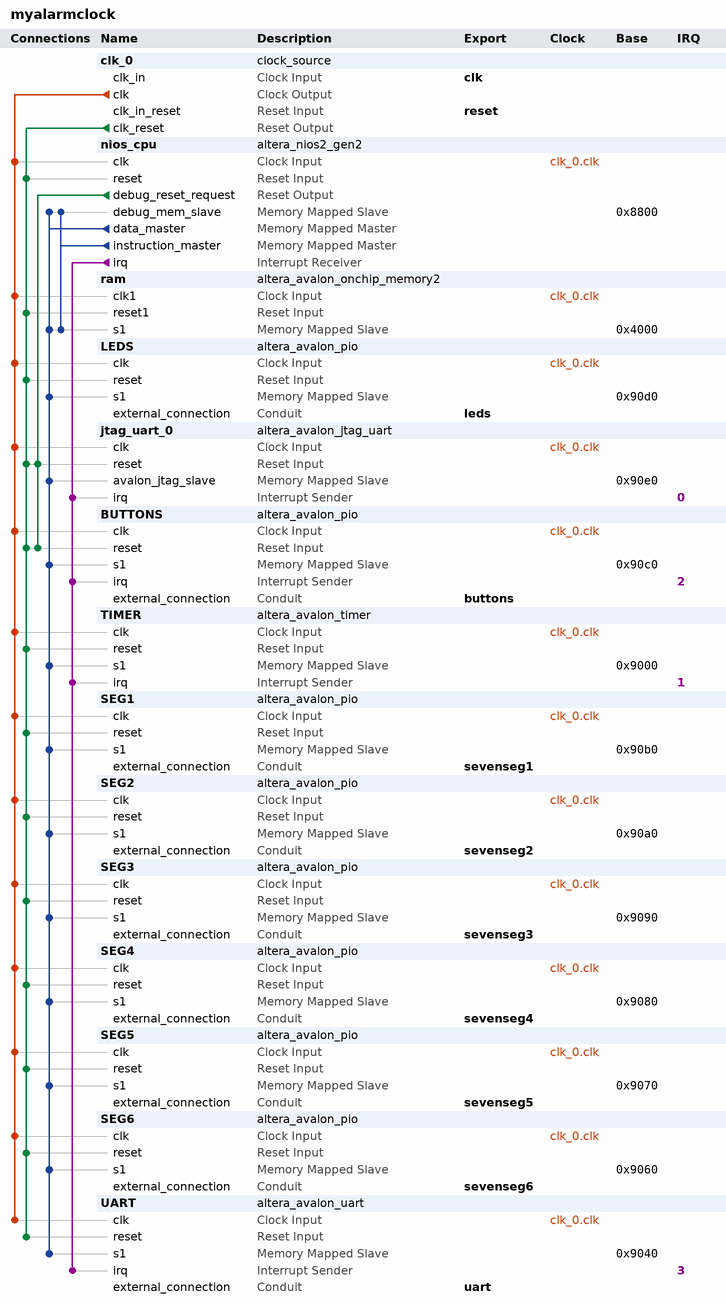
[diagram p0: system contents]
# Platform Designer (Qsys) system myalarmclock, Cyclone V 5CSEMA5F31C6
# Parameters at their usual value, and those the tool derives, are not listed.
package require -exact qsys 18.1
create_system myalarmclock
set_project_property DEVICE_FAMILY {Cyclone V}
set_project_property DEVICE 5CSEMA5F31C6

add_instance clk_0 clock_source 18.1
set_instance_parameter_value clk_0 clockFrequency 50000000

add_instance nios_cpu altera_nios2_gen2 18.1
set_instance_parameter_value nios_cpu dcache_size 2048
set_instance_parameter_value nios_cpu exceptionSlave ram.s1
set_instance_parameter_value nios_cpu icache_size 4096
set_instance_parameter_value nios_cpu impl Tiny
set_instance_parameter_value nios_cpu resetSlave ram.s1

add_instance ram altera_avalon_onchip_memory2 18.1
set_instance_parameter_value ram dataWidth 32
set_instance_parameter_value ram dualPort false
set_instance_parameter_value ram initMemContent true
set_instance_parameter_value ram initializationFileName onchip_mem.hex
set_instance_parameter_value ram memorySize 12288

add_instance LEDS altera_avalon_pio 18.1
set_instance_parameter_value LEDS direction Output
set_instance_parameter_value LEDS width 8

add_instance jtag_uart_0 altera_avalon_jtag_uart 18.1
set_instance_parameter_value jtag_uart_0 simInteractiveOptions NO_INTERACTIVE_WINDOWS

add_instance BUTTONS altera_avalon_pio 18.1
set_instance_parameter_value BUTTONS captureEdge true
set_instance_parameter_value BUTTONS direction Input
set_instance_parameter_value BUTTONS generateIRQ true
set_instance_parameter_value BUTTONS irqType EDGE
set_instance_parameter_value BUTTONS width 4

add_instance TIMER altera_avalon_timer 18.1
set_instance_parameter_value TIMER fixedPeriod true
set_instance_parameter_value TIMER period 1
set_instance_parameter_value TIMER periodUnits SEC

add_instance SEG1 altera_avalon_pio 18.1
set_instance_parameter_value SEG1 direction Output
set_instance_parameter_value SEG1 width 7

add_instance SEG2 altera_avalon_pio 18.1
set_instance_parameter_value SEG2 direction Output
set_instance_parameter_value SEG2 width 7

add_instance SEG3 altera_avalon_pio 18.1
set_instance_parameter_value SEG3 direction Output
set_instance_parameter_value SEG3 width 7

add_instance SEG4 altera_avalon_pio 18.1
set_instance_parameter_value SEG4 direction Output
set_instance_parameter_value SEG4 width 7

add_instance SEG5 altera_avalon_pio 18.1
set_instance_parameter_value SEG5 direction Output
set_instance_parameter_value SEG5 width 8

add_instance SEG6 altera_avalon_pio 18.1
set_instance_parameter_value SEG6 direction Output
set_instance_parameter_value SEG6 width 8

add_instance UART altera_avalon_uart 18.1
set_instance_parameter_value UART baud 9600
set_instance_parameter_value UART dataBits 8
set_instance_parameter_value UART fixedBaud true
set_instance_parameter_value UART parity NONE
set_instance_parameter_value UART stopBits 1

# connections
add_connection clk_0.clk BUTTONS.clk clock
add_connection clk_0.clk jtag_uart_0.clk clock
add_connection clk_0.clk LEDS.clk clock
add_connection clk_0.clk nios_cpu.clk clock
add_connection clk_0.clk ram.clk1 clock
add_connection clk_0.clk SEG1.clk clock
add_connection clk_0.clk SEG2.clk clock
add_connection clk_0.clk SEG3.clk clock
add_connection clk_0.clk SEG4.clk clock
add_connection clk_0.clk SEG5.clk clock
add_connection clk_0.clk SEG6.clk clock
add_connection clk_0.clk TIMER.clk clock
add_connection clk_0.clk UART.clk clock
add_connection clk_0.clk_reset BUTTONS.reset reset
add_connection clk_0.clk_reset jtag_uart_0.reset reset
add_connection clk_0.clk_reset LEDS.reset reset
add_connection clk_0.clk_reset nios_cpu.reset reset
add_connection clk_0.clk_reset ram.reset1 reset
add_connection clk_0.clk_reset SEG1.reset reset
add_connection clk_0.clk_reset SEG2.reset reset
add_connection clk_0.clk_reset SEG3.reset reset
add_connection clk_0.clk_reset SEG4.reset reset
add_connection clk_0.clk_reset SEG5.reset reset
add_connection clk_0.clk_reset SEG6.reset reset
add_connection clk_0.clk_reset TIMER.reset reset
add_connection clk_0.clk_reset UART.reset reset
add_connection nios_cpu.debug_reset_request BUTTONS.reset reset
add_connection nios_cpu.debug_reset_request jtag_uart_0.reset reset
add_connection nios_cpu.data_master BUTTONS.s1 avalon
set_connection_parameter_value nios_cpu.data_master/BUTTONS.s1 baseAddress 0x90c0
add_connection nios_cpu.data_master jtag_uart_0.avalon_jtag_slave avalon
set_connection_parameter_value nios_cpu.data_master/jtag_uart_0.avalon_jtag_slave baseAddress 0x90e0
add_connection nios_cpu.data_master LEDS.s1 avalon
set_connection_parameter_value nios_cpu.data_master/LEDS.s1 baseAddress 0x90d0
add_connection nios_cpu.data_master nios_cpu.debug_mem_slave avalon
set_connection_parameter_value nios_cpu.data_master/nios_cpu.debug_mem_slave baseAddress 0x8800
add_connection nios_cpu.data_master ram.s1 avalon
set_connection_parameter_value nios_cpu.data_master/ram.s1 baseAddress 0x4000
add_connection nios_cpu.data_master SEG1.s1 avalon
set_connection_parameter_value nios_cpu.data_master/SEG1.s1 baseAddress 0x90b0
add_connection nios_cpu.data_master SEG2.s1 avalon
set_connection_parameter_value nios_cpu.data_master/SEG2.s1 baseAddress 0x90a0
add_connection nios_cpu.data_master SEG3.s1 avalon
set_connection_parameter_value nios_cpu.data_master/SEG3.s1 baseAddress 0x9090
add_connection nios_cpu.data_master SEG4.s1 avalon
set_connection_parameter_value nios_cpu.data_master/SEG4.s1 baseAddress 0x9080
add_connection nios_cpu.data_master SEG5.s1 avalon
set_connection_parameter_value nios_cpu.data_master/SEG5.s1 baseAddress 0x9070
add_connection nios_cpu.data_master SEG6.s1 avalon
set_connection_parameter_value nios_cpu.data_master/SEG6.s1 baseAddress 0x9060
add_connection nios_cpu.data_master TIMER.s1 avalon
set_connection_parameter_value nios_cpu.data_master/TIMER.s1 baseAddress 0x9000
add_connection nios_cpu.data_master UART.s1 avalon
set_connection_parameter_value nios_cpu.data_master/UART.s1 baseAddress 0x9040
add_connection nios_cpu.instruction_master nios_cpu.debug_mem_slave avalon
set_connection_parameter_value nios_cpu.instruction_master/nios_cpu.debug_mem_slave baseAddress 0x8800
add_connection nios_cpu.instruction_master ram.s1 avalon
set_connection_parameter_value nios_cpu.instruction_master/ram.s1 baseAddress 0x4000
add_connection nios_cpu.irq BUTTONS.irq interrupt
set_connection_parameter_value nios_cpu.irq/BUTTONS.irq irqNumber 2
add_connection nios_cpu.irq jtag_uart_0.irq interrupt
set_connection_parameter_value nios_cpu.irq/jtag_uart_0.irq irqNumber 0
add_connection nios_cpu.irq TIMER.irq interrupt
set_connection_parameter_value nios_cpu.irq/TIMER.irq irqNumber 1
add_connection nios_cpu.irq UART.irq interrupt
set_connection_parameter_value nios_cpu.irq/UART.irq irqNumber 3

# exported interfaces
add_interface buttons conduit end
set_interface_property buttons EXPORT_OF BUTTONS.external_connection
add_interface clk clock sink
set_interface_property clk EXPORT_OF clk_0.clk_in
add_interface leds conduit end
set_interface_property leds EXPORT_OF LEDS.external_connection
add_interface reset reset sink
set_interface_property reset EXPORT_OF clk_0.clk_in_reset
add_interface sevenseg1 conduit end
set_interface_property sevenseg1 EXPORT_OF SEG1.external_connection
add_interface sevenseg2 conduit end
set_interface_property sevenseg2 EXPORT_OF SEG2.external_connection
add_interface sevenseg3 conduit end
set_interface_property sevenseg3 EXPORT_OF SEG3.external_connection
add_interface sevenseg4 conduit end
set_interface_property sevenseg4 EXPORT_OF SEG4.external_connection
add_interface sevenseg5 conduit end
set_interface_property sevenseg5 EXPORT_OF SEG5.external_connection
add_interface sevenseg6 conduit end
set_interface_property sevenseg6 EXPORT_OF SEG6.external_connection
add_interface uart conduit end
set_interface_property uart EXPORT_OF UART.external_connection

set_interconnect_requirement {$system} qsys_mm.clockCrossingAdapter HANDSHAKE
set_interconnect_requirement {$system} qsys_mm.enableEccProtection FALSE
set_interconnect_requirement {$system} qsys_mm.insertDefaultSlave FALSE
set_interconnect_requirement {$system} qsys_mm.maxAdditionalLatency 1

save_system myalarmclock.qsys
